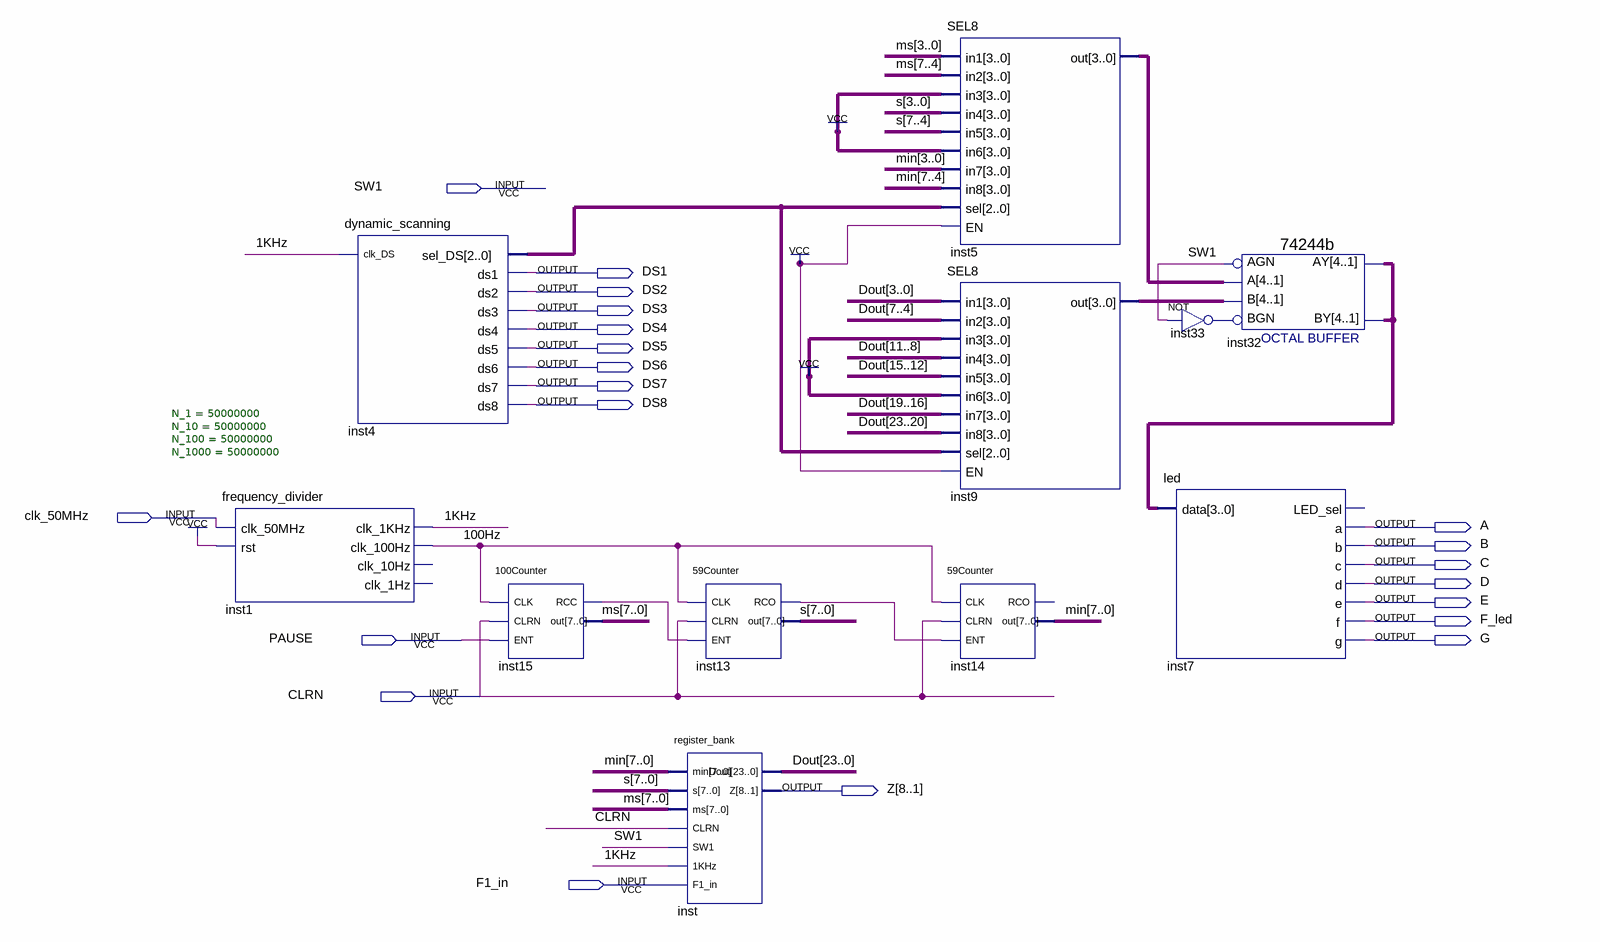
[diagram p0: schematic sheet]
// Quartus schematic chronograph.bdf as structural Verilog: 11 symbols, 21 pins
module chronograph (
  input  SW1,
  input  clk_50MHz,
  input  PAUSE,
  input  CLRN,
  input  F1_in,
  output DS1,
  output DS2,
  output DS3,
  output DS4,
  output DS5,
  output DS6,
  output DS7,
  output DS8,
  output A,
  output B,
  output C,
  output D,
  output E,
  output F_led,
  output G,
  output [8:1] Z
);

  wire \1KHz , \100Hz , inst13_rco, inst15_rcc, inst33_out;
  wire [2:0] inst4_sel_ds;
  wire [3:0] inst5_out, inst9_out, inst32_ay;
  wire [7:0] min, ms, s;
  wire [23:0] Dout;

  frequency_divider #(.N_1(50000000), .N_10(50000000), .N_100(50000000), .N_1000(50000000)) inst1 (
    .clk_50MHz(clk_50MHz), .rst(1'b1), .clk_1KHz(\1KHz ), .clk_100Hz(\100Hz ));  // open: clk_10Hz, clk_1Hz
  dynamic_scanning inst4 (
    .clk_DS(\1KHz ), .sel_DS(inst4_sel_ds), .ds1(DS1), .ds2(DS2), .ds3(DS3), .ds4(DS4), .ds5(DS5), .ds6(DS6),
    .ds7(DS7), .ds8(DS8));
  \100Counter  inst15 (.CLRN(CLRN), .ENT(PAUSE), .CLK(\100Hz ), .RCC(inst15_rcc), .out(ms));
  register_bank inst (
    .min(min), .s(s), .ms(ms), .CLRN(CLRN), .SW1(SW1), .\1KHz (\1KHz ), .F1_in(F1_in), .Dout(Dout), .Z(Z));
  \59Counter  inst13 (.ENT(inst15_rcc), .CLRN(CLRN), .CLK(\100Hz ), .RCO(inst13_rco), .out(s));
  SEL8 inst5 (
    .in1(ms[3:0]), .in2(ms[7:4]), .in3(4'b1111), .in4(s[3:0]), .in5(s[7:4]), .in6(4'b1111), .in7(min[3:0]),
    .in8(min[7:4]), .sel(inst4_sel_ds), .EN(1'b1), .out(inst5_out));
  SEL8 inst9 (
    .in1(Dout[3:0]), .in2(Dout[7:4]), .in3(4'b1111), .in4(Dout[11:8]), .in5(Dout[15:12]), .in6(4'b1111),
    .in7(Dout[19:16]), .in8(Dout[23:20]), .sel(inst4_sel_ds), .EN(1'b1), .out(inst9_out));
  \59Counter  inst14 (.ENT(inst13_rco), .CLRN(CLRN), .CLK(\100Hz ), .out(min));  // open: RCO
  not inst33 (inst33_out, SW1);
  led inst7 (.data(inst32_ay), .a(A), .b(B), .c(C), .d(D), .e(E), .f(F_led), .g(G));  // open: LED_sel
  \74244b  inst32 (.AGN(SW1), .B(inst9_out), .BGN(inst33_out), .A(inst5_out), .AY(inst32_ay), .BY(inst32_ay));
endmodule
